# EAGLE schematic TVHR3-USB-ISO-AUDIO (EAGLE 7.2.0)
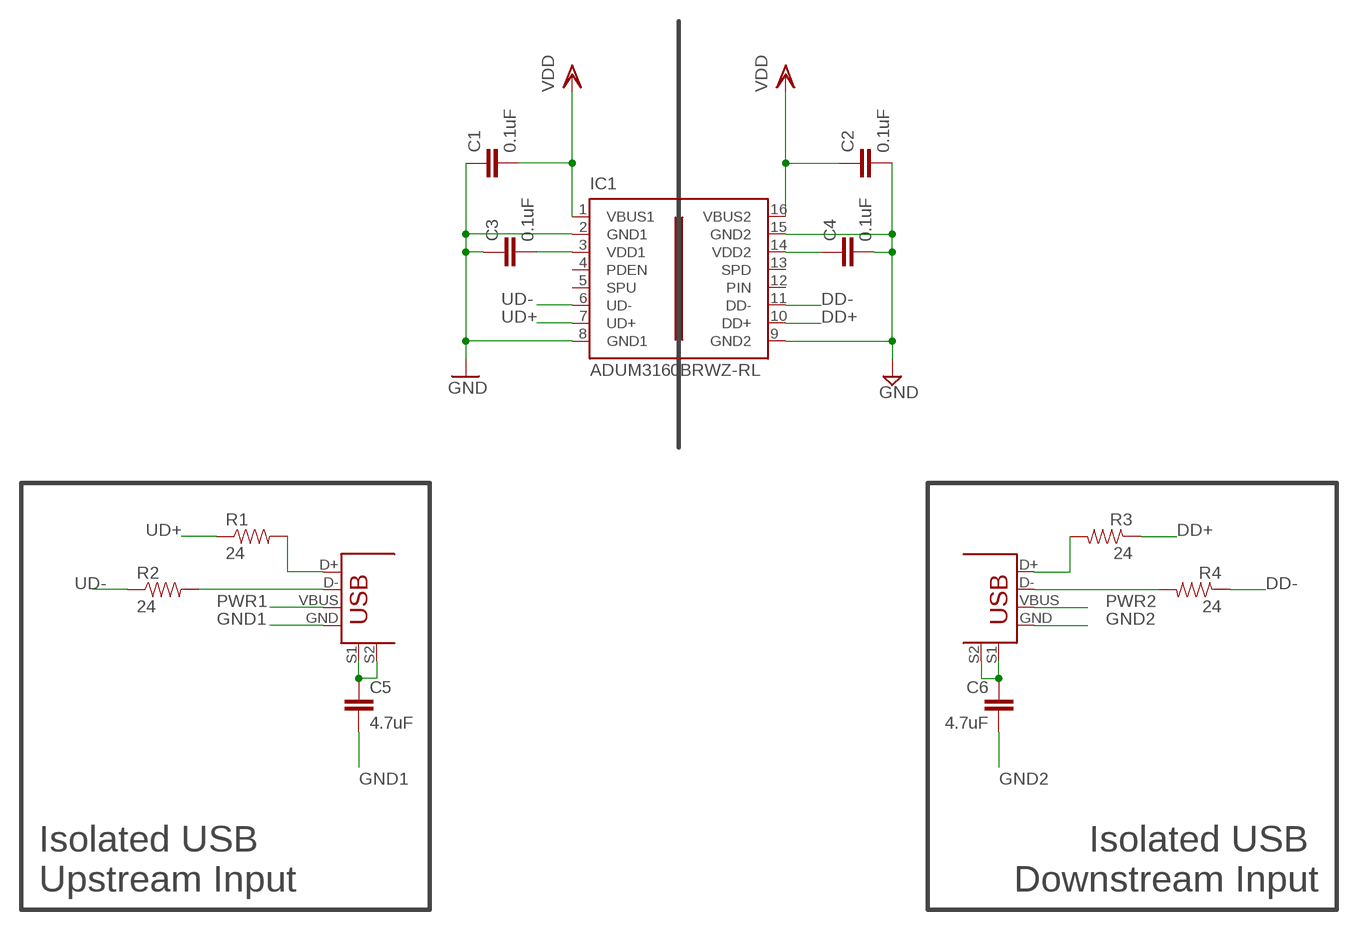
[diagram p0: schematic, sheet 1]

## Parts
C1  0.1uF  0.1UF-25V-5%(0603)  [0603-CAP]
C2  0.1uF  0.1UF-25V-5%(0603)  [0603-CAP]
C3  0.1uF  0.1UF-25V-5%(0603)  [0603-CAP]
C4  0.1uF  0.1UF-25V-5%(0603)  [0603-CAP]
C5  4.7uF  4.7UF-16V-20%,+80%-(1206)  [1206-CAP]
C6  4.7uF  4.7UF-16V-20%,+80%-(1206)  [1206-CAP]
IC1  ADUM3160BRWZ-RL  [SO-16W]
R1  24  22OHM1/10W1%(0603)  [0603-RES]
R2  24  22OHM1/10W1%(0603)  [0603-RES]
R3  24  22OHM1/10W1%(0603)  [0603-RES]
R4  24  22OHM1/10W1%(0603)  [0603-RES]
U$1  USB+SHIELD  [USB-B-PTH]
U$2  USB+SHIELD  [USB-B-PTH]

## Nets
DD+ [DD+]: IC1.10(DD+) R3.1 R3.2 U$2.D+
DD- [DD-]: IC1.11(DD-) R4.1 R4.2 U$2.D-
GND1: C1.1 C3.1 C5.1 C5.2 C6.1 IC1.2(GND1) IC1.8(GND1) U$1.GND U$1.S1 U$1.S2 U$2.S1 U$2.S2 ; supply symbol labelled GND
GND2 [GND2]: C2.2 C4.2 C6.2 IC1.9(GND2) IC1.15(GND2) U$2.GND ; supply symbol labelled GND
N$1 [UD+]: R1.2 U$1.D+
N$2: C3.2 IC1.3(VDD1)
N$3 [UD-]: R2.2 U$1.D-
N$4 [GND2]: C4.1 IC1.14(VDD2)
PWR1 [PWR1]: U$1.VBUS
PWR2 [PWR2]: U$2.VBUS
UD+ [UD+]: IC1.7(UD+) R1.1
UD- [UD+]: IC1.6(UD-) R2.1
VDD1 [PWR2]: C1.2 IC1.1(VBUS1) ; supply symbol labelled VDD
VDD2 [PWR2]: C2.1 IC1.16(VBUS2) ; supply symbol labelled VDD
Unconnected: IC1.4(PDEN) IC1.5(SPU) IC1.12(PIN) IC1.13(SPD)

## Notes on the sheet
- Isolated USB 
  Upstream Input
- Isolated USB 
  Downstream Input

## Library data of the parts
C1-C4 = SparkFun-Capacitors:0.1UF-25V-5%(0603): CAP-08604; PROD_ID: CAP-08604
C5 C6 = SparkFun-Capacitors:4.7UF-16V-20%,+80%-(1206): CAP-10300; PROD_ID: CAP-10300
IC1 = TVHeadedRobots-library:ADUM3160BRWZ-RL: Full/Low Speed 2.5 kV USB Digital Isolator Source: http://www.analog.com/media/en/technical-documentation/data-sheets/ADuM3160.pdf; MF: Analog Devices Inc.; MPN: ADUM3160BRWZ-RL; OC_MOUSER: 584-ADUM3160BRWZ-R
R1-R4 = SparkFun-Resistors:22OHM1/10W1%(0603): RES-08698; PROD_ID: RES-08698; VALUE: 22
U$1 U$2 = SparkFun-Connectors:USB+SHIELD: USB+Shield USB connector with shield pins connectable

## Net classes
0 GND1: width 0.762 mm, clearance 0.127 mm
1 GND2: width 0.762 mm, clearance 0.127 mm
2 Signal: width 0.254 mm, clearance 0.051 mm
3 PWR1: width 0.762 mm, clearance 0.127 mm
4 PWR2: width 0.762 mm, clearance 0.127 mm
5 Shield: width 2.54 mm, clearance 0.254 mm
6 DD+: width 0.254 mm, clearance 0.127 mm
7 DD-: width 0.254 mm, clearance 0.051 mm
8 UD+: width 0.254 mm, clearance 0.051 mm
9 UD-: width 0.254 mm, clearance 0.051 mm